# EAGLE design Zio Qwiic PM2.5 Sensor Adapter (EAGLE 9.2.2)
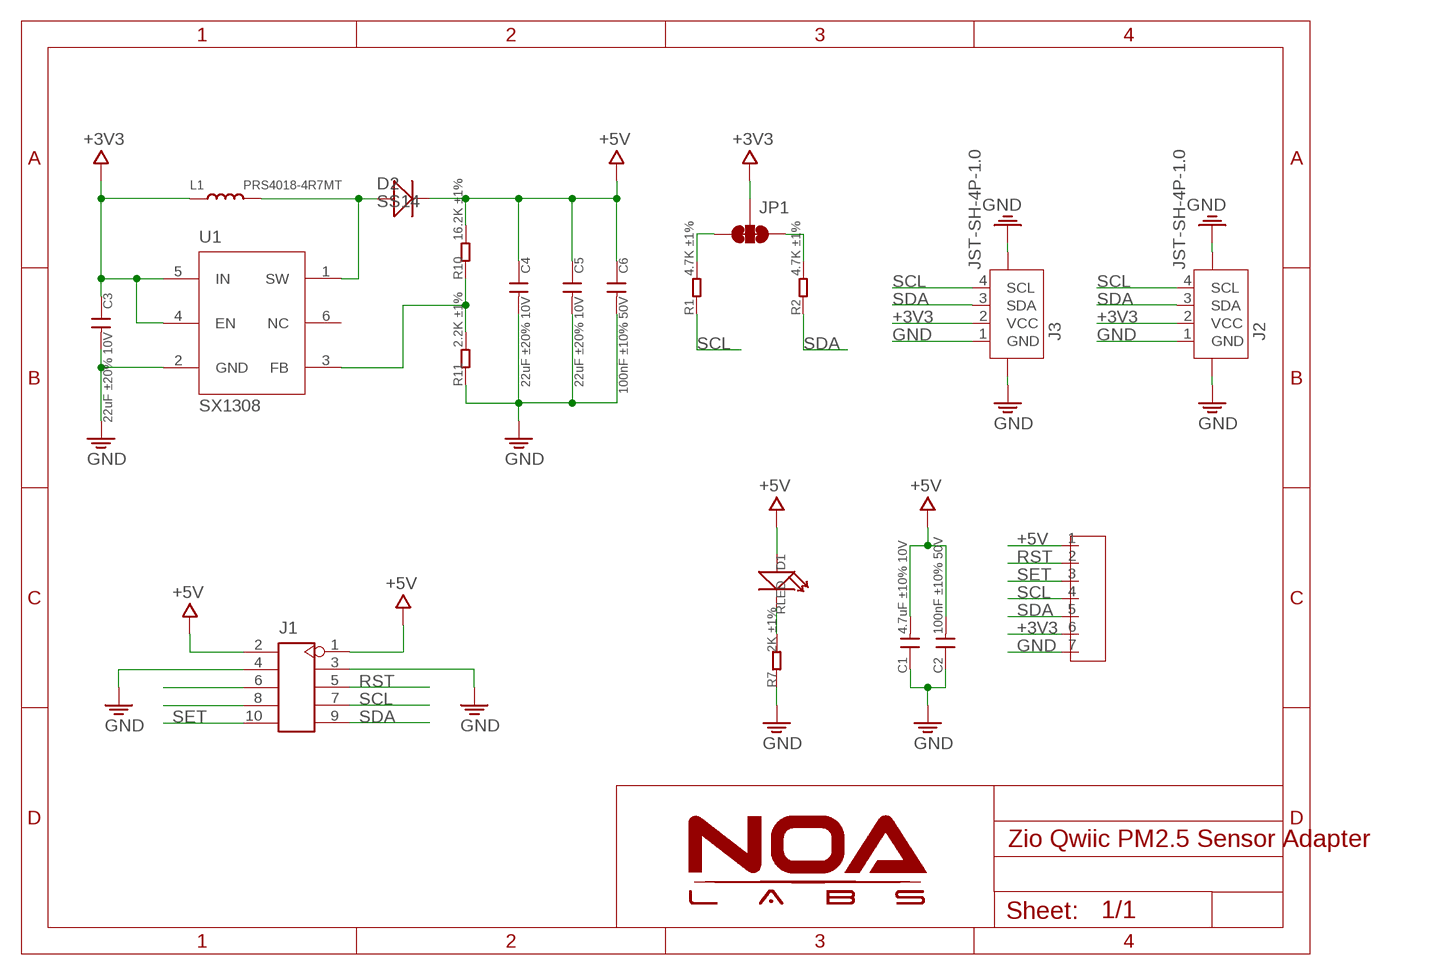
[diagram p0: schematic, sheet 1]

## Parts
C1  4.7uF ±10% 10V  C-0603  [C0603]
C2  100nF ±10% 50V  C-0603  [C0603]
C3  22uF ±20% 10V  C-0805  [C0805]
C4  22uF ±20% 10V  C-0805  [C0805]
C5  22uF ±20% 10V  C-0805  [C0805]
C6  100nF ±10% 50V  C-0603  [C0603]
D1  RLED  LED'0603'  [LED-0603]
D2  SS14  D214AA  [DO-214AC]
J1  HEADER-2X5P-PM2.5  [2X5P-1.27-THT-PM2.5]
J2  JST-SH-4P-1.0  [JST-SH-4P]
J3  JST-SH-4P-1.0  [JST-SH-4P]
J5  HEADER-7P  [7P-2.54-60/35MIL]
JP1  SMT-JUMPER_3_2-NC_TRACE  [SMT-JUMPER_3_2-NC_TRACE]
L1  PRS4018-4R7MT  L-4030  [L4030]
R1  4.7K ±1%  R-0603  [R0603]
R2  4.7K ±1%  R-0603  [R0603]
R7  2K ±1%  R-0603  [0603]
R10  16.2K ±1%  R-0603  [R0603]
R11  2.2K ±1%  R-0603  [R0603]
U1  SX1308  [SOT23-6]

## Nets
+3V3: C3.1 J2.2(VCC) J3.2(VCC) J5.6 JP1.2 L1.1 U1.4(EN) U1.5(IN)
+5V: C1.2 C2.2 C4.1 C5.1 C6.1 D1.+ D2.C(-) J1.1 J1.2 J5.1 R10.2
GND: C1.1 C2.1 C3.2 C4.2 C5.2 C6.2 J1.3 J1.4 J2.1(GND) J2.NC1 J2.NC2 J3.1(GND) J3.NC1 J3.NC2 J5.7 R7.1 R11.1 U1.2(GND)
N$1: JP1.1 R2.2
N$2: D1.- R7.2
N$6: JP1.3 R1.2
N$7: R10.1 R11.2 U1.3(FB)
NC1: J1.6
NC2: J1.8
RST: J1.5 J5.2
SCL: J1.7 J2.4(SCL) J3.4(SCL) J5.4 R1.1
SDA: J1.9 J2.3(SDA) J3.3(SDA) J5.5 R2.1
SET: J1.10 J5.3
SW: D2.A(+) L1.2 U1.1(SW)
Unconnected: U1.6(NC)

## Library data of the parts
C1-C6 = RCL:C
D1 = Discretex:LED*
D2 = Discrete_NOA:D*
J1 = Connector:HEADER-2X5P-PM2.5
J2 J3 = Connector:JST-SH-4P
J5 = Connector_NOA:HEADER-7P
JP1 = NOA-Jumpers:SMT-JUMPER_3_2-NC_TRACE
L1 = Discrete:L*
R1 R2 R10 R11 = RCL:R
R7 = Discretex:R*
U1 = IC:SX1308

## Board
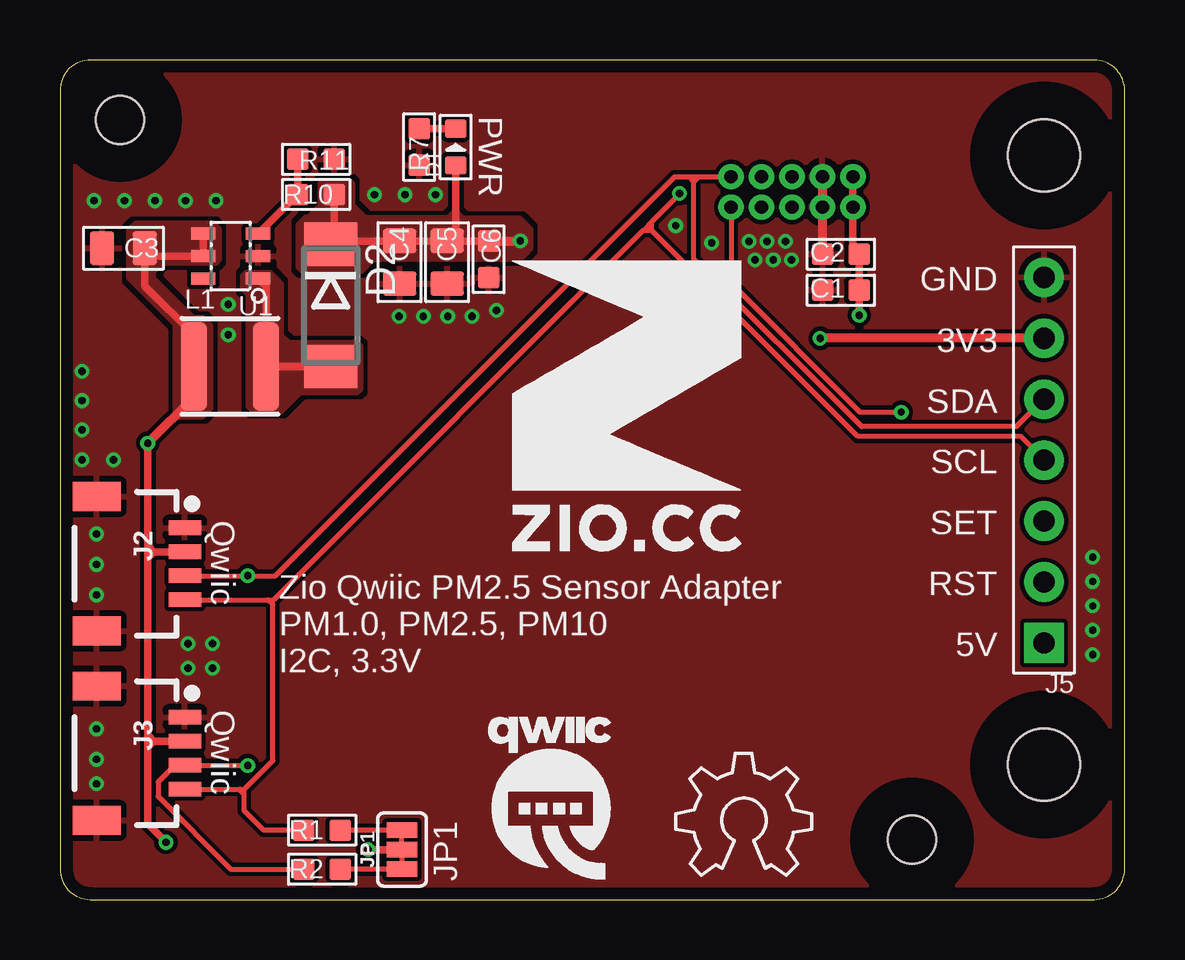
[diagram p1: board, top side]
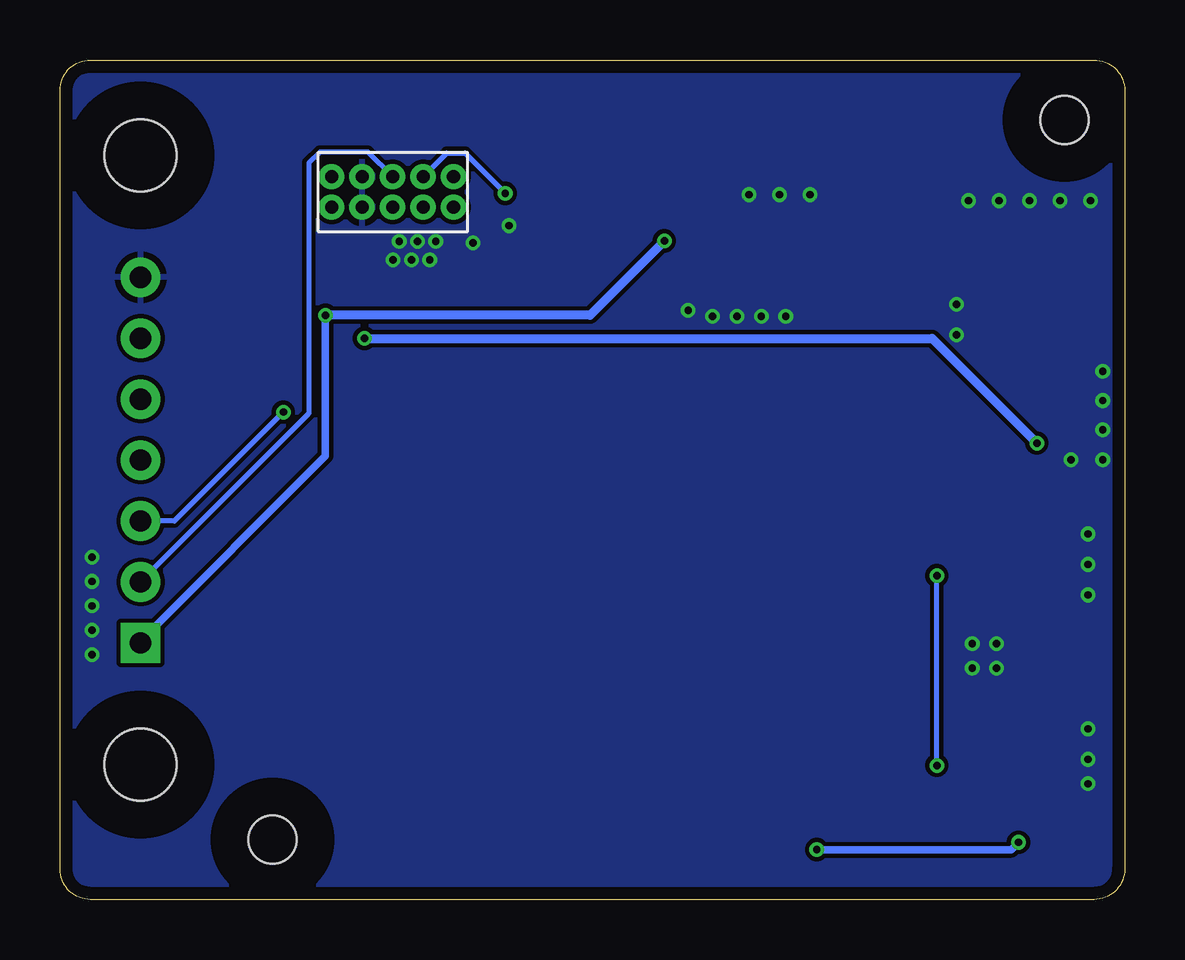
[diagram p2: board, bottom side, seen from below]

Size 44.36 x 35 mm. Coordinates in mm from the lower left corner, seen from the top.
Outline: 0,33.73 0,1.27 arc90 1.27,0 43.09,0 arc90 44.36,1.27 44.36,33.73 arc90 43.09,35 1.27,35 arc90 0,33.73
Copper layers (1*16): Top 0.035mm / dielectric 1.5mm / Bottom 0.035mm
Design rules "NOA Eagle Rule": minimum track width 7mil, minimum drill 12mil, track to track 7mil, track to pad 7mil, pad to pad 7mil, via to via 7mil, smd to smd 0mil, copper to edge 20mil, drill to drill 10mil, minimum pad ring 10mil, minimum via ring 6mil, stop-mask expansion 2mil, vias tented up to drill 25mil, thermal gap 10mil
Holes 2 mm at 2.5,32.5 35.5,2.5
Holes 3 mm at 41,5.62 41,31.02
tRestrict: area 33,0 to 38,5; area 0,30 to 5,35; area 38,28 to 44,34; area 38,2.6 to 44,8.6
bRestrict: area 38,2.6 to 44,8.6; area 0,30 to 5,35; area 33,0 to 38,5; area 38,28 to 44,34

### Footprints (pad centres in the part's own frame; a part is rotated, then mirrored left to right if it is on the bottom)
C0603 = smd 0.889 x 0.889: 1 -0.762,0; 2 0.762,0
C0805 = smd 1.016 x 1.397: 1 -0.889,0; 2 0.889,0
LED-0603 = smd 0.762 x 0.889: + -0.762,0; - 0.762,0
DO-214AC = smd 1.8 x 2.2: A 2.55,0; C -2.55,0
2X5P-1.27-THT-PM2.5 = drill 0.55: 1 -2.54,0.635; 2 -2.54,-0.635; 3 -1.27,0.635; 4 -1.27,-0.635; 5 0,0.635; 6 0,-0.635; 7 1.27,0.635; 8 1.27,-0.635; 9 2.54,0.635; 10 2.54,-0.635
JST-SH-4P = smd 0.6 x 1.35: 1 1.5,0; 2 0.5,0; 3 -0.5,0; 4 -1.5,0 | smd 1.2 x 2: NC1 -2.8,3.675; NC2 2.8,3.675
7P-2.54-60/35MIL = drill 0.889 pad 1.651 square: 1 0,7.62 | drill 0.889 pad 1.651: 2 0,5.08; 3 0,2.54; 4 0,0; 5 0,-2.54; 6 0,-5.08; 7 0,-7.62
SMT-JUMPER_3_2-NC_TRACE = smd 0.635 x 1.27: 1 -0.813,0; 2 0,0; 3 0.813,0
L4030 = smd 1.1 x 3.7: 1 -1.5,0; 2 1.5,0
R0603 = smd 0.889 x 0.889: 1 -0.762,0; 2 0.762,0
0603 = smd 0.889 x 0.889: 1 -0.762,0; 2 0.762,0
SOT23-6 = smd 0.508 x 1.016: 1 -0.94,-1.143; 2 0,-1.143; 3 0.94,-1.143; 4 0.94,1.143; 5 0,1.143; 6 -0.94,1.143

### Placement (x,y rotation side)
C1  32.54,25.4 0 top
C2  32.54,26.9 0 top
C3  2.64,27.15 180 top
C4  14.15,26.57 270 top
C5  16.13,26.57 270 top
C6  17.86,26.7 270 top
D1  16.48,31.37 90 top
D2  11.28,24.77 270 top
J1  30.5,29.5 0 bottom
J2  5.2,14 90 top
J3  5.2,6.1 90 top
J5  41,18.32 180 top
JP1  14.25,2.08 90 top
L1  7.09,22.23 0 top
R1  10.92,2.9 0 top
R2  10.92,1.27 0 top
R7  14.96,31.37 90 top
R10  10.67,29.39 0 top
R11  10.67,30.86 180 top
U1  7.11,26.82 90 top
U$6  [QWIIC-LOGO-MEDIUM]  20.4,4.29 0 top
U$7  [OSHW_6X200_NOTEXT]  25.65,1.02 0 top
U$9  [12MM]  18.75,14.45 0 top

### Tracks (layer width: path | path; a pad name or v marks a point on that pad's centre or on a via)
+3V3  (via drill 0.3)
  Top 0.305: v3.66,19.02 3.66,14.76 | 3.66,14.76 3.66,14.24 | 3.66,14.24 3.66,6.86 | 3.66,6.86 3.66,6.34 | 3.66,6.34 3.66,3.15 v4.42,2.39 | JP1.2 v12.83,2.08 | J3.2 3.92,6.6 | 3.92,6.6 3.66,6.86 | 3.92,6.6 3.66,6.34 | 5.59,20.95 L1.1 5.59,22.45 5.59,23.52 3.53,25.58 C3.1 3.86,26.82 U1.5 U1.4 | J2.2 3.92,14.5 | 3.92,14.5 3.66,14.76 | 3.92,14.5 3.66,14.24
  Top 0.381: J5.6 v31.68,23.4 v31.67,23.39 | v3.66,19.02 5.59,20.95 5.59,22.45
  Bottom 0.305: v12.83,2.08 4.72,2.08 v4.42,2.39
  Bottom 0.381: v3.66,19.02 8.03,23.39 v31.67,23.39
  pour Top (no thermals): 4.78,20.32 4.78,23.98 2.84,25.91 2.84,27.91 3.15,28.22 6.38,28.22 6.65,27.94 6.65,26.67 6.5,26.52 4.27,26.52 3.91,26.16 3.91,25.91 4.83,24.99 5.56,24.26 5.97,24.26 6.3,23.93 6.3,20.55 6.3,20.47 6.05,20.22 5.92,20.09 4.9,20.09 4.78,20.22
+5V  (via drill 0.3)
  Top 0.305: v33.3,24.36 C1.2 C2.2 33.04,27.16 J1.2 J1.1 | R10.2 11.43,27.47 D2.C 11.42,27.46 C4.1 C5.1 | C5.1 C6.1 | D1.+ 16.48,27.81 C5.1
  Top 0.381: C6.1 v19.18,27.46
  Bottom 0.305: v33.3,24.36 33.3,18.49 41,10.79 J5.1
  Bottom 0.381: v19.18,27.46 22.28,24.36 v33.3,24.36
  pour Top (no thermals): 10.95,30 12.06,30 12.22,29.84 12.22,28.96 12.73,28.45 16.18,28.45 16.38,28.65 16.56,28.65 16.79,28.42 19.15,28.42 19.51,28.07 19.63,27.94 19.63,27.13 19.38,26.87 19.18,26.67 13.06,26.67 12.57,26.19 10.08,26.19 9.91,26.37 9.91,27.79 9.91,28.14 10.24,28.47 10.36,28.47 10.82,28.93 10.82,29.87
GND  (via drill 0.3)
  Top 0.381: J1.3 J1.4 C2.1
  other vias: 1.52,7.11 1.52,5.84 1.52,4.83 5.33,9.65 5.33,10.67 6.35,10.67 6.35,9.65 1.52,15.24 1.52,13.97 1.52,12.7 0.91,19.58 0.91,20.8 0.91,22.02 2.24,18.34 0.91,18.34 28.7,27.43 29.46,27.43 30.23,27.43 28.96,26.67 29.72,26.67 30.48,26.67 43.03,11.23 43.03,12.24 43.03,13.26 43.03,14.27 43.03,10.21 1.42,29.13 2.69,29.13 3.96,29.13 5.23,29.13 6.5,29.13 13.11,29.39 14.38,29.39 15.65,29.39 14.12,24.31 15.14,24.31 16.15,24.31 17.17,24.31 18.19,24.56 7.01,23.55 7.01,24.82 27.15,27.38 25.65,28.09
  pour Top (rank 2): 0,35 44.36,35 44.36,0 0,0
  pour Bottom (rank 2): 0,35 44.36,35 44.36,0 0,0
N$1
  Top 0.203: JP1.1 R2.2
N$2
  Top 0.305: D1.- R7.2
N$6
  Top 0.203: JP1.3 R1.2
N$7
  Top 0.305: U1.3 9.88,29.39 R10.1 R11.2
RST
  Bottom 0.203: J1.5 31.53,31.17 33.53,31.17 33.98,30.71 33.98,20.27 41,13.25 J5.2
SCL  (via drill 0.3)
  Top 0.203: J2.4 8.66,12.5 | 8.66,12.5 8.87,12.5 | 8.87,12.5 8.9,12.5 24.26,27.86 24.29,27.89 | v25.81,29.44 25.81,29.41 24.65,28.25 | 24.65,28.25 24.29,27.89 | J3.4 7.49,4.6 | 7.49,4.6 7.67,4.6 | 8.87,12.29 8.87,5.79 7.67,4.6 | 8.87,12.29 8.87,12.5 | 8.87,12.29 8.66,12.5 | R1.1 8.48,2.9 7.67,3.71 7.67,4.39 | 7.67,4.39 7.67,4.6 | 7.67,4.39 7.49,4.58 7.49,4.6 | J5.4 41,18.33 40.03,19.3 33.24,19.3 24.65,27.89 | 24.65,27.89 24.65,28.25 | 24.65,27.89 24.29,27.89
  Bottom 0.203: v25.81,29.44 27.48,31.11 28.25,31.11 J1.7
SDA  (via drill 0.3)
  Top 0.203: J2.3 v7.82,13.5 8.98,13.5 25.61,30.14 26.21,30.14 | 26.21,30.14 26.62,30.14 | 26.62,30.14 J1.9 | v7.82,5.59 v7.81,5.6 J3.3 4.79,5.6 4.09,4.9 4.09,4.29 7.11,1.27 R2.1 | 26.42,29.93 26.21,30.14 | 26.42,29.93 26.42,26.7 33.4,19.71 39.85,19.71 J5.5 | 26.42,29.93 26.62,30.14
  Bottom 0.203: v7.82,5.59 v7.82,13.5
SET  (via drill 0.3)
  Top 0.203: J1.10 27.96,25.69 33.33,20.32 v35.05,20.32
  Bottom 0.203: v35.05,20.32 39.59,15.78 J5.3
SW
  Top 0.305: U1.1 8.59,25.55 L1.2 11.27,22.23 D2.A
  pour Top (no thermals): 7.75,26.16 8.76,26.16 8.86,26.06 9.25,25.68 9.25,23.52 9.53,23.24 12.09,23.24 12.37,23.24 12.55,23.06 12.55,21.26 12.4,21.11 10.01,21.11 9.22,20.32 8.05,20.32 7.82,20.55 7.82,25.22 7.59,25.45 7.59,26.01

### Text on the board
tPlace: PWR | GND | 3V3 | SDA | SCL | Qwiic | SET | RST | 5V | Zio Qwiic PM2.5 Sensor Adapter / PM1.0, PM2.5, PM10 / I2C, 3.3V | Qwiic | JP1